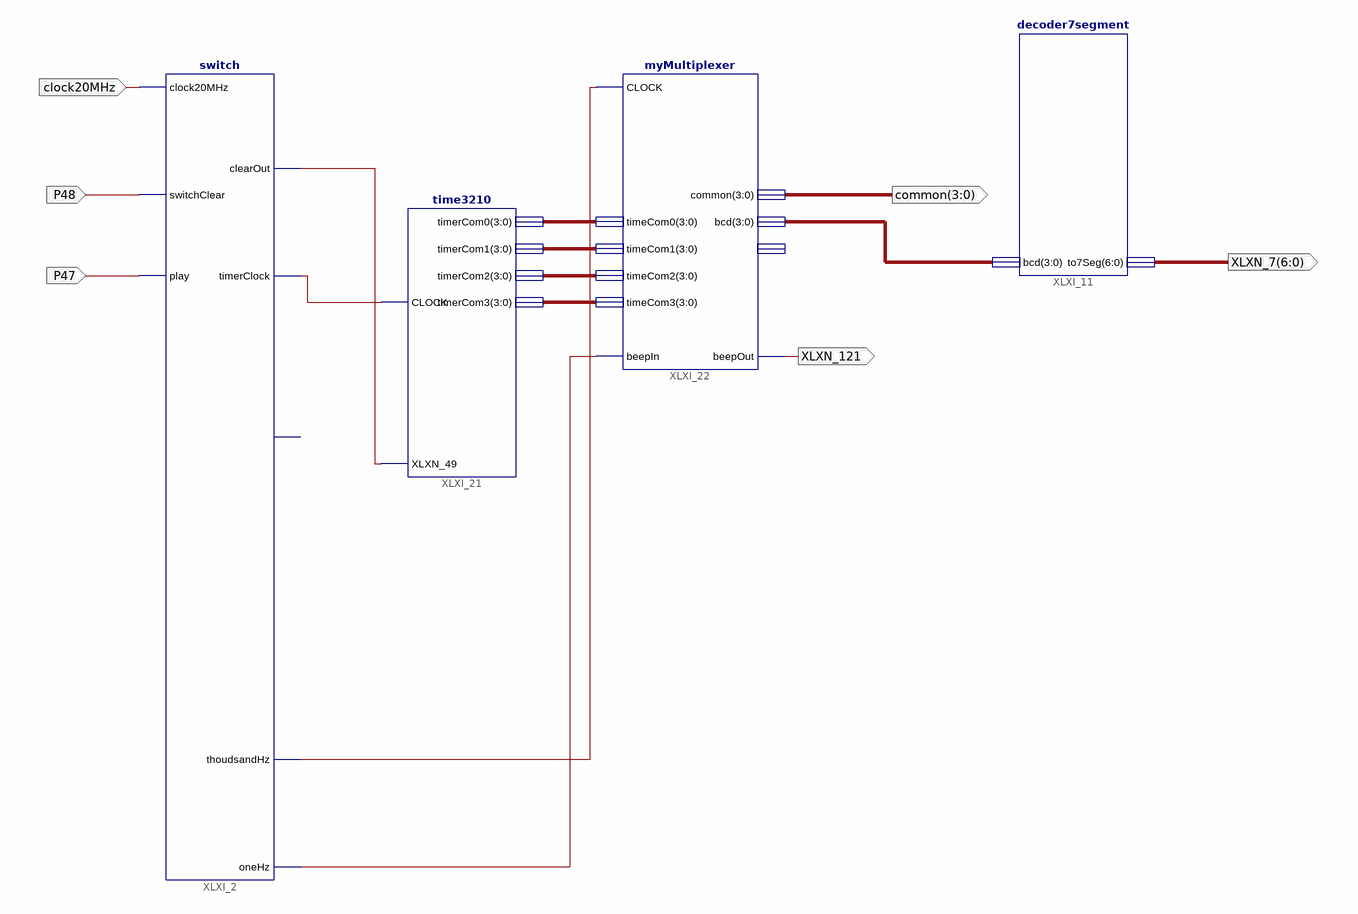
[diagram p0: schematic sheet 1]
// Xilinx ISE schematic testCombine.sch (spartan6) as structural Verilog: 4 symbols, 6 ports
module testCombine (
  input  clock20MHz,
  input  P47,
  input  P48,
  output [6:0] XLXN_7,
  output [3:0] common,
  output XLXN_121
);

  wire XLXN_88, XLXN_106, XLXN_154, XLXN_155;
  wire [3:0] XLXN_78, XLXN_79, XLXN_80, XLXN_81, XLXN_84;

  decoder7segment XLXI_11 (.bcd(XLXN_84), .to7Seg(XLXN_7));
  myMultiplexer XLXI_22 (
    .CLOCK(XLXN_88), .timeCom0(XLXN_78), .timeCom1(XLXN_79), .timeCom2(XLXN_80), .timeCom3(XLXN_81),
    .common(common), .bcd(XLXN_84), .beepIn(XLXN_155), .beepOut(XLXN_121));
  time3210 XLXI_21 (
    .CLOCK(XLXN_154), .XLXN_49(XLXN_106), .timerCom0(XLXN_78), .timerCom2(XLXN_80), .timerCom3(XLXN_81),
    .timerCom1(XLXN_79));
  switch XLXI_2 (
    .clock20MHz(clock20MHz), .play(P47), .switchClear(P48), .timerClock(XLXN_154), .clearOut(XLXN_106),
    .thoudsandHz(XLXN_88), .oneHz(XLXN_155));  // open: twoHz

  // Notes on the sheet:
  //   CLOCK_DEDICATED_ROUTE on signal P47 = TRUE
endmodule
